# Altium schematic sheet AMS1117 3_3V.SchDoc
size OrCAD A
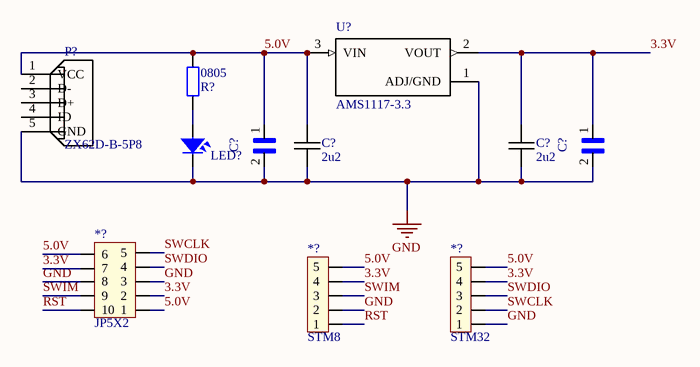
[diagram p0: AMS1117 3_3V.SchDoc]

## Parts
(Parts that share a designator on the sheet are numbered #1, #2 ... from top to bottom, then left to right.)
*?#1  JP5X2  [JP5X2]
*?#2  STM8  [JP5]
*?#3  STM32  [JP5]
C?#1  2u2  [0805C-GENERIC]
C?#2  2u2  [0805C-GENERIC]
C?#3  C3216X5R1A106K160AB  [CAPC3216X180]  (value not drawn)
C?#4  C3216X5R1A106K160AB  [CAPC3216X180]  (value not drawn)
LED?  LED  [LED-5-RED]  (value not drawn)
P?  ZX62D-B-5P8  [HRS_ZX62D-B-5P8]
R?  value 0805  [DIEN TRO 0805]  (hidden comment: R0805)
U?  AMS1117-3.3  [SOT229P700X180-4N]

## Nets
GND: *?#1.3 *?#1.8 *?#2.2 *?#3.1 C?#1.2 C?#2.2 C?#3.2 C?#4.2 LED?.2 P?.5(GND) U?.1(ADJ/GND)
3.3V: *?#1.2 *?#1.7 *?#2.4 *?#3.4 C?#2.1 C?#4.1 U?.2(VOUT)
5.0V: *?#1.1 *?#1.6 *?#2.5 *?#3.5 C?#1.1 C?#3.1 P?.1(VCC) R?.2 U?.3(VIN)
RST: *?#1.10 *?#2.1
SWCLK: *?#1.5 *?#3.2
SWDIO: *?#1.4 *?#3.3
SWIM: *?#1.9 *?#2.3
NetLED?_1: LED?.1 R?.1

Not connected (* = marked no-connect by the designer): P? 2(D-) 3(D+) 4(ID)

## Notes on the sheet
- Title
- Size:
- Date:
- Orcad A
- Number:
- Time:
- Revision:
- Sheet
- of
- File:

## Library data of the parts
*?#2 *?#3 = JP5
C?#1 C?#2 = 0805C-2U2-6V3-X5R-PAN: CAPACITOR 0805 CERAMIC; Manufacturer Part Number: ECJ-1VB0J225K; Manufacturer: Panasonic - ECG; Reel: C7; Supplier 1: Digi-Key; Supplier Part Number 1: PCC2273TR-ND
C?#3 C?#4 = C3216X5R1A106K160AB: C Series 1206 10 uF 10 V Â±10 % Tolerance X5R SMT Multilayer Ceramic Capacitor; MF: TDK; SnapEDA_Link: https://www.snapeda.com/parts/C3216X5R1A106K160AB/TDK/view-part/?ref=snap; Availability: Unavailable; Price: 0.19 USD; Package: 1206 TDK; MP: C3216X5R1A106K160AB; Value: *
LED? = LED: LED Single colour Green and Red; Value: LED 3 ly Single Colour
P? = ZX62D-B-5P8: SMD+DIP Micro USB; MICRO-B-SMD; MF: Hirose; SnapEDA_Link: https://www.snapeda.com/parts/ZX62D-B-5P8/Hirose%20Electric%20Co%20Ltd/view-part/?ref=snap; Price: None; Availability: Unavailable; MP: ZX62D-B-5P8; Package: None; Value: *
R? = R0805: Resistor SMD 0805; Published: 8-Jun-2000; LatestRevisionDate: 17-Jul-2002; LatestRevisionNote: Re-released for DXP Platform.; PackageReference: AXIAL-0.4; Publisher: Altium Limited
U? = AMS1117-3.3: Sot223/Pkg 1-Amp 3.3-Volt Low Drop Out Voltage Regulatator; MF: Advanced Monolithic Systems; SnapEDA_Link: https://www.snapeda.com/parts/AMS1117-3.3/Advanced%20Monolithic%20Systems/view-part/?ref=snap; Availability: Unavailable; MP: AMS1117-3.3; Price: None; Package: None; Value: *